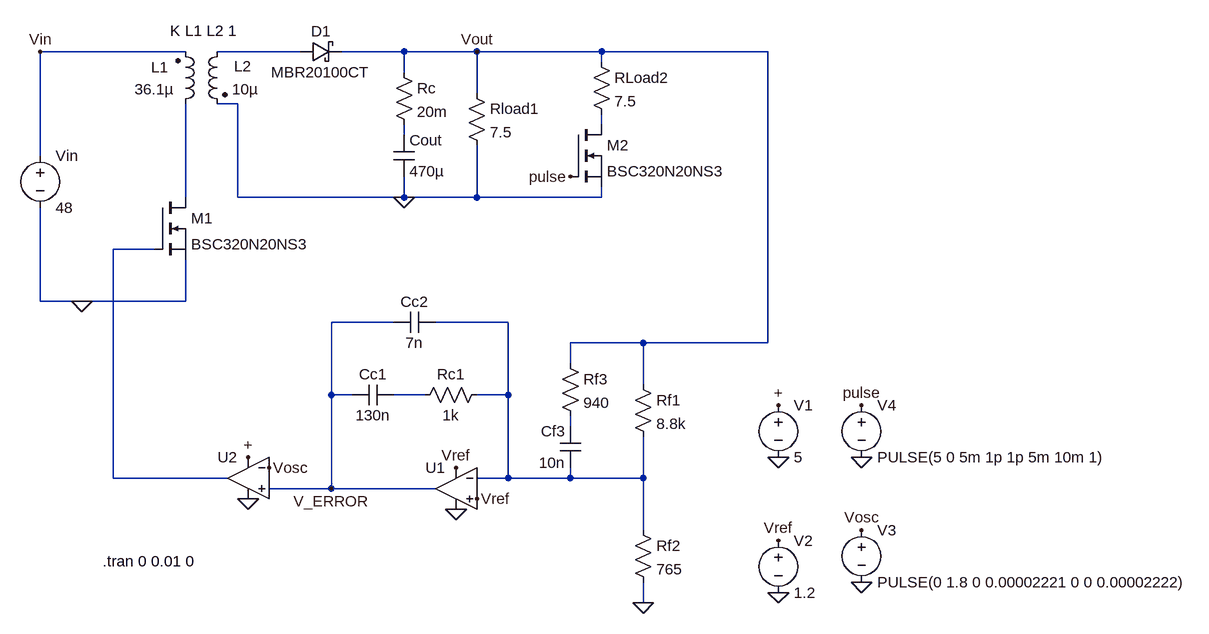
[diagram p0: schematic flyback_compensated.asc]
flyback_compensated.asc, the LTspice schematic file:
Version 4
SHEET 1 1392 680
WIRE -208 -432 -432 -432
WIRE -32 -432 -160 -432
WIRE 128 -432 32 -432
WIRE 240 -432 128 -432
WIRE 432 -432 240 -432
WIRE 688 -432 432 -432
WIRE 432 -416 432 -432
WIRE 128 -400 128 -432
WIRE 240 -368 240 -432
WIRE -128 -352 -160 -352
WIRE 432 -320 432 -336
WIRE 128 -304 128 -320
WIRE -432 -272 -432 -432
WIRE -208 -208 -208 -352
WIRE -128 -208 -128 -352
WIRE 128 -208 128 -240
WIRE 128 -208 -128 -208
WIRE 240 -208 240 -288
WIRE 240 -208 128 -208
WIRE 432 -208 432 -224
WIRE 432 -208 240 -208
WIRE -256 -128 -320 -128
WIRE -432 -48 -432 -192
WIRE -368 -48 -432 -48
WIRE -208 -48 -208 -112
WIRE -208 -48 -368 -48
WIRE 112 -16 16 -16
WIRE 288 -16 176 -16
WIRE 496 16 384 16
WIRE 688 16 688 -432
WIRE 688 16 496 16
WIRE 384 48 384 16
WIRE 496 80 496 16
WIRE 16 96 16 -16
WIRE 48 96 16 96
WIRE 160 96 112 96
WIRE 288 96 288 -16
WIRE 288 96 240 96
WIRE 384 144 384 128
WIRE -320 224 -320 -128
WIRE -144 224 -320 224
WIRE 288 224 288 96
WIRE 288 224 240 224
WIRE 384 224 384 208
WIRE 384 224 288 224
WIRE 496 224 496 160
WIRE 496 224 384 224
WIRE 16 240 16 96
WIRE 16 240 -80 240
WIRE 176 240 16 240
WIRE 496 304 496 224
WIRE 496 416 496 384
FLAG -368 -48 0
FLAG 128 -208 0
FLAG -432 -432 Vin
FLAG 240 -432 Vout
FLAG 496 416 0
FLAG 704 192 0
FLAG 704 400 0
FLAG 208 208 Vref
FLAG 704 112 +
FLAG 240 256 Vref
FLAG 704 320 Vref
FLAG -112 192 +
FLAG -80 208 Vosc
FLAG 832 384 0
FLAG 832 304 Vosc
FLAG 208 272 0
FLAG -112 256 0
FLAG 832 192 0
FLAG 832 112 pulse
FLAG 16 240 V_ERROR
FLAG 384 -240 pulse
SYMBOL ind2 -144 -448 M0
WINDOW 0 -37 38 Left 2
WINDOW 3 -48 74 Left 2
SYMATTR InstName L2
SYMATTR Value 10µ
SYMATTR Type ind
SYMBOL ind2 -224 -336 M180
WINDOW 0 -37 72 Left 2
WINDOW 3 -63 38 Left 2
SYMATTR InstName L1
SYMATTR Value 36.1µ
SYMATTR Type ind
SYMBOL nmos -256 -208 R0
SYMATTR InstName M1
SYMATTR Value BSC320N20NS3
SYMBOL voltage -432 -288 R0
WINDOW 123 0 0 Left 2
WINDOW 39 0 0 Left 2
SYMATTR InstName Vin
SYMATTR Value 48
SYMBOL cap 112 -304 R0
SYMATTR InstName Cout
SYMATTR Value 470µ
SYMBOL res 224 -384 R0
SYMATTR InstName Rload1
SYMATTR Value 7.5
SYMBOL res 416 -432 R0
SYMATTR InstName RLoad2
SYMATTR Value 7.5
SYMBOL nmos 384 -320 R0
SYMATTR InstName M2
SYMATTR Value BSC320N20NS3
SYMBOL res 480 64 R0
SYMATTR InstName Rf1
SYMATTR Value 8.8k
SYMBOL res 480 288 R0
SYMATTR InstName Rf2
SYMATTR Value 765
SYMBOL res 368 32 R0
SYMATTR InstName Rf3
SYMATTR Value 940
SYMBOL cap 400 208 R180
WINDOW 0 24 56 Left 2
WINDOW 3 24 8 Left 2
SYMATTR InstName Cf3
SYMATTR Value 10n
SYMBOL Opamps\\UniversalOpamp2 208 240 M0
SYMATTR InstName U1
SYMBOL voltage 704 96 R0
WINDOW 123 0 0 Left 2
WINDOW 39 0 0 Left 2
SYMATTR InstName V1
SYMATTR Value 5
SYMBOL voltage 704 304 R0
WINDOW 123 0 0 Left 2
WINDOW 39 0 0 Left 2
SYMATTR InstName V2
SYMATTR Value 1.2
SYMBOL res 256 80 R90
WINDOW 0 0 56 VBottom 2
WINDOW 3 32 56 VTop 2
SYMATTR InstName Rc1
SYMATTR Value 1k
SYMBOL cap 48 112 R270
WINDOW 0 32 32 VTop 2
WINDOW 3 0 32 VBottom 2
SYMATTR InstName Cc1
SYMATTR Value 130n
SYMBOL cap 112 0 R270
WINDOW 0 32 32 VTop 2
WINDOW 3 0 32 VBottom 2
SYMATTR InstName Cc2
SYMATTR Value 7n
SYMBOL voltage 832 288 R0
WINDOW 123 0 0 Left 2
WINDOW 39 0 0 Left 2
SYMATTR InstName V3
SYMATTR Value PULSE(0 1.8 0 0.00002221 0 0 0.00002222)
SYMBOL Opamps\\UniversalOpamp2 -112 224 M0
SYMATTR InstName U2
SYMBOL voltage 832 96 R0
WINDOW 123 0 0 Left 2
WINDOW 39 0 0 Left 2
SYMATTR InstName V4
SYMATTR Value PULSE(5 0 5m 1p 1p 5m 10m 1)
SYMBOL res 112 -416 R0
SYMATTR InstName Rc
SYMATTR Value 20m
SYMBOL schottky -32 -416 R270
WINDOW 0 32 32 VTop 2
WINDOW 3 0 32 VBottom 2
SYMATTR InstName D1
SYMATTR Value MBR20100CT
SYMATTR Description Diode
SYMATTR Type diode
TEXT -232 -464 Left 2 !K L1 L2 1
TEXT -336 352 Left 2 !.tran 0 0.01 0

The netlist it stands for:
* flyback_compensated.asc
L2 N001 0 10µ
L1 N004 Vin 36.1µ
M1 N004 N005 0 0 BSC320N20NS3
Vin Vin 0 48
Cout N003 0 470µ
Rload1 Vout 0 7.5
RLoad2 Vout N002 7.5
M2 N002 pulse 0 0 BSC320N20NS3
Rf1 Vout N006 8.8k
Rf2 N006 0 765
Rf3 Vout N008 940
Cf3 N006 N008 10n
XU1 Vref N006 Vref 0 V_ERROR level.2 Avol=1Meg GBW=10Meg Slew=10Meg ilimit=25m rail=0 Vos=0 phimargin=45 en=0 enk=0 in=0 ink=0 Rin=500Meg  ; pins IN+ IN- V+ V- OUT
V1 + 0 5
V2 Vref 0 1.2
Rc1 N006 N007 1k
Cc1 V_ERROR N007 130n
Cc2 V_ERROR N006 7n
V3 Vosc 0 PULSE(0 1.8 0 0.00002221 0 0 0.00002222)
XU2 V_ERROR Vosc + 0 N005 level.2 Avol=1Meg GBW=10Meg Slew=10Meg ilimit=25m rail=0 Vos=0 phimargin=45 en=0 enk=0 in=0 ink=0 Rin=500Meg  ; pins IN+ IN- V+ V- OUT
V4 pulse 0 PULSE(5 0 5m 1p 1p 5m 10m 1)
Rc Vout N003 20m
D1 N001 Vout MBR20100CT
.model D D
.lib standard.dio
.model NMOS NMOS
.model PMOS PMOS
.lib standard.mos
K L1 L2 1
.tran 0 0.01 0
.lib UniversalOpamps2.sub
.backanno
.end